# Altium schematic sheet BTB_CONN.SchDoc: =project_title
size Tabloid; CompanyName: Luxonis Holding; Organization: Luxonis Holding; Address1: 1925 Harmony Park Drive; Address2: Westminster, CO; Address3: 80234; Address4: United States; SheetNumber: 4; SheetTotal: 13
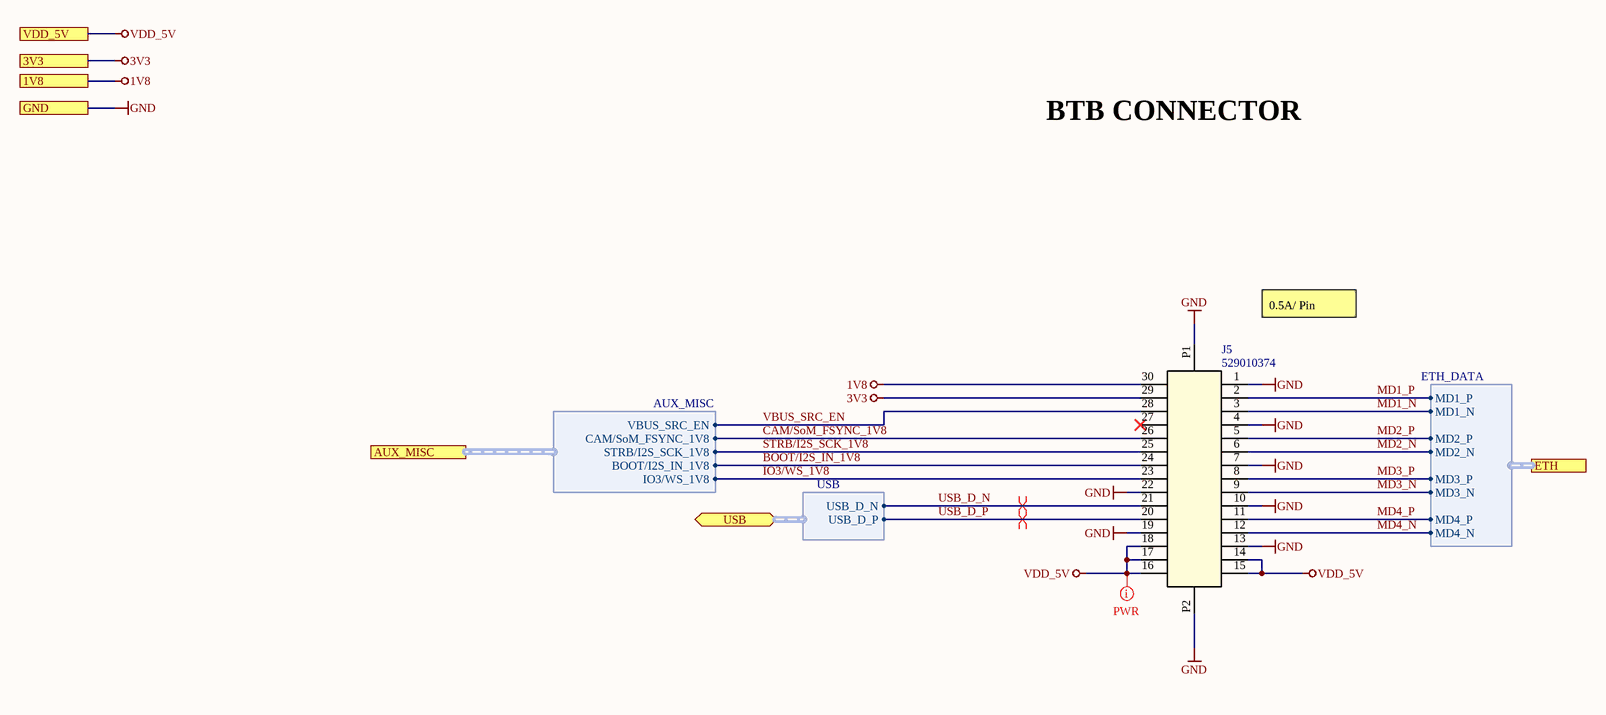
[diagram p0: BTB_CONN.SchDoc]

## Parts
J5  529010374  [CON_529010374]

## Ports
1V8, 3V3, AUX_MISC (harness AUX_MISC), ETH (harness ETH_DATA), GND, USB (bidir, harness USB), VDD_5V

## Harnesses
ETH_DATA: MD1_P, MD1_N, MD2_P, MD2_N, MD3_P, MD3_N, MD4_P, MD4_N
USB: USB_D_P, USB_D_N
AUX_MISC: VBUS_SRC_EN, CAM/SoM_FSYNC_1V8, STRB/I2S_SCK_1V8, BOOT/I2S_IN_1V8, IO3/WS_1V8

## Nets
1V8: J5.30 ; port 1V8
3V3: J5.29 ; port 3V3
GND: J5.1 J5.4 J5.7 J5.10 J5.13 J5.19 J5.22 J5.P1 J5.P2 ; port GND
VDD_5V: J5.14 J5.15 J5.16 J5.17 J5.18 ; port VDD_5V
BOOT/I2S_IN_1V8: J5.24 ; port AUX_MISC.BOOT/I2S_IN_1V8
CAM/SoM_FSYNC_1V8: J5.26 ; port AUX_MISC.CAM/SoM_FSYNC_1V8
IO3/WS_1V8: J5.23 ; port AUX_MISC.IO3/WS_1V8
MD1_N: J5.3 ; port ETH.MD1_N
MD1_P: J5.2 ; port ETH.MD1_P
MD2_N: J5.6 ; port ETH.MD2_N
MD2_P: J5.5 ; port ETH.MD2_P
MD3_N: J5.9 ; port ETH.MD3_N
MD3_P: J5.8 ; port ETH.MD3_P
MD4_N: J5.12 ; port ETH.MD4_N
MD4_P: J5.11 ; port ETH.MD4_P
STRB/I2S_SCK_1V8: J5.25 ; port AUX_MISC.STRB/I2S_SCK_1V8
USB_D_N: J5.21 ; port USB.USB_D_N
USB_D_P: J5.20 ; port USB.USB_D_P
VBUS_SRC_EN: J5.28 ; port AUX_MISC.VBUS_SRC_EN

Not connected (* = marked no-connect by the designer): J5 27*

## Layout directives
differential pair; net class USB2; differential pair class 90ohm: USB_D_N, USB_D_P
net class PWR; Current Rating: 3A: VDD_5V

## Notes on the sheet
- BTB CONNECTOR
- 0.5A/ Pin
- Title
- Size:
- Date:
- Tabloid
- Number:
- Time:
- Revision:
- Sheet
- of
- Drawn by:

## Library data of the parts
J5 = CMP-002-00150-7: CONN, Board-to-Board Connector, Mezzanine, 0.635mm pitch, 2x15, 30 positions, Receptacle, Mated height 12 to 16mm; Manufacturer 1: Molex; Max Current Rating: 500mA; Voltage Rating: 100V; Connector Type: BOARD STACKING CONNECTOR; Manufacturer Part Number 1: 529010374; Mounting Technology: Board; Pins: 2x15; Max Operating Temperature: 105°C; Min Operating Temperature: -55°C; System: connector